# Altium schematic sheet Vertigo Core.SchDoc
size A2; PageSetup: Record=PageOptions|CenterHorizontal=True|CenterVertical=True|PrintScale=0.71|XCorrection=1.00|YCorrection=1.00|PrintKind=1|BorderSize=5000000|LeftOffset=0|BottomOffset=0|Orientation=2|PaperLength=1000|PaperWidth=1000|Scale=100|PaperSource=7|PrintQuality=-4|MediaType=1|DitherType=10|PaperKind=A3 (297 x 420 mm)|PrintScaleMode=1
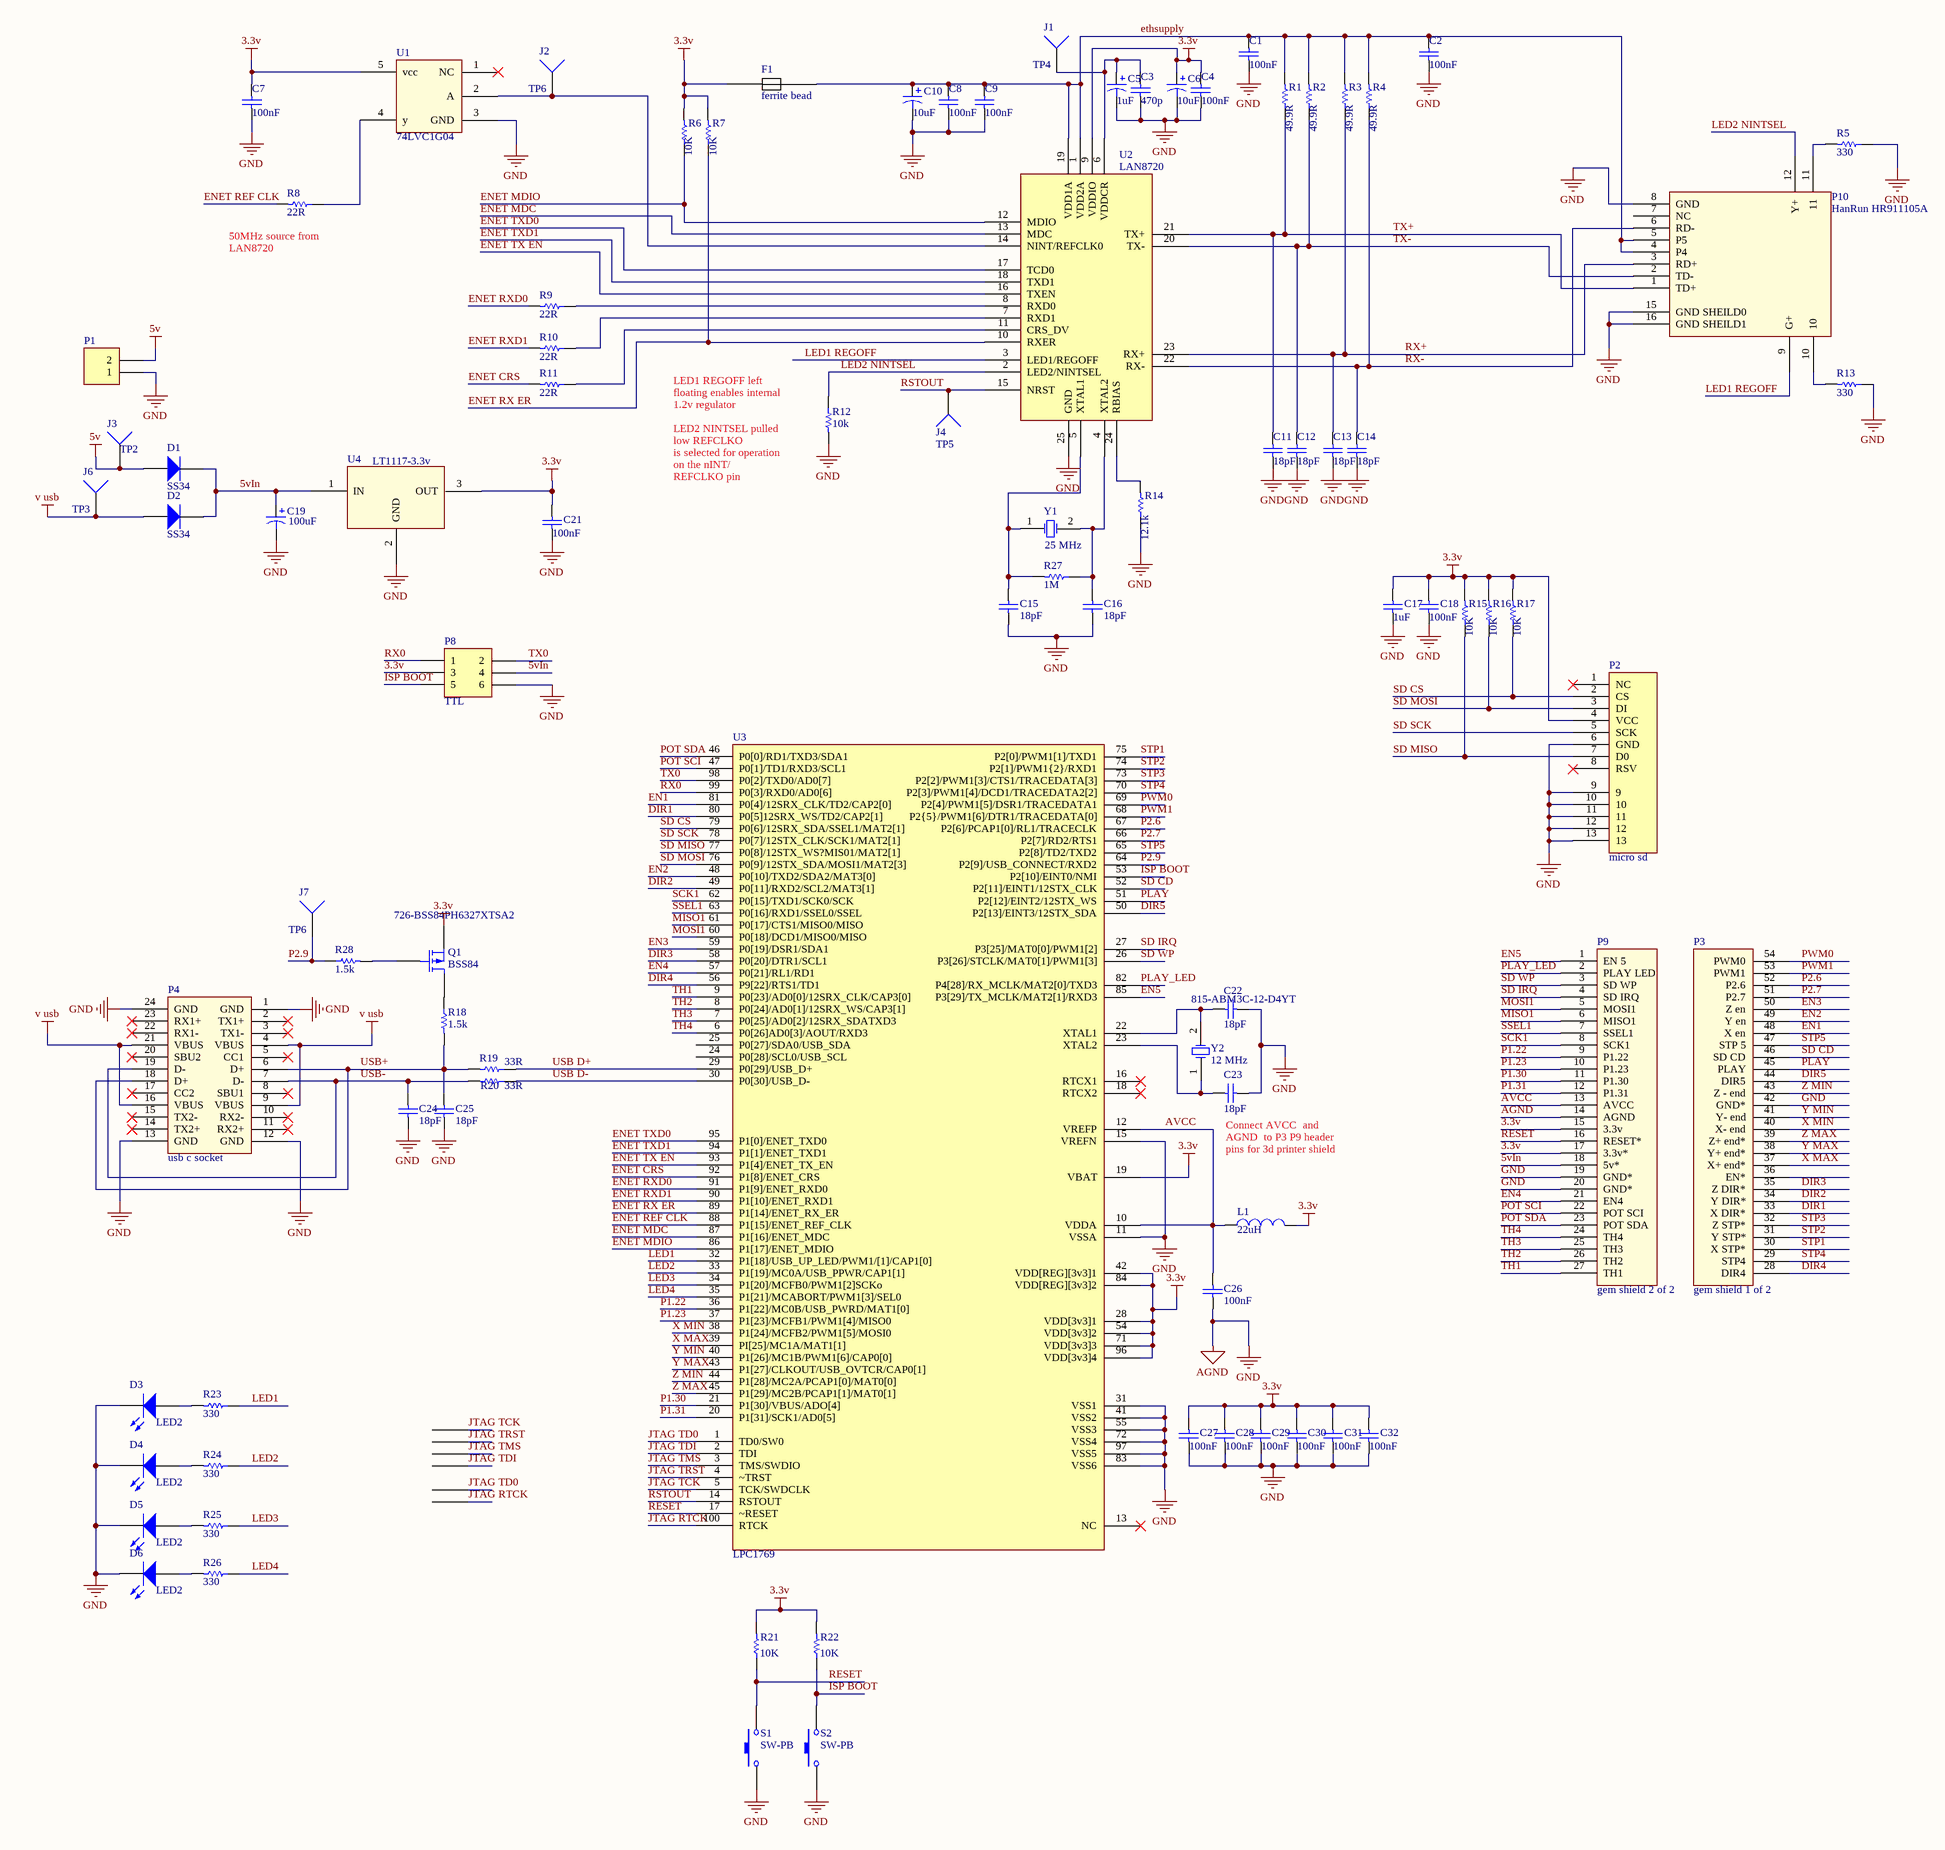
[diagram p0: Vertigo Core.SchDoc]

## Parts
C1  100nF  [0805]
C2  100nF  [0805]
C3  value 470p  [0805]  (hidden comment: 470pF)
C4  100nF  [0805]
C5  1uF  [0805]
C6  10uF  [0805]
C7  100nF  [0805]
C8  100nF  [0805]
C9  100nF  [0805]
C10  10uF  [0805]
C11  18pf  [0805]
C12  18pf  [0805]
C13  18pf  [0805]
C14  18pf  [0805]
C15  18pF  [0805]
C16  18pF  [0805]
C17  1uF  [0805]
C18  100nF  [0805]
C19  value 100uF  [470uf/ 100uf 50v smd]  (hidden comment: 10uF)
C21  100nF  [0805]
C22  18pF  [0805]
C23  18pF  [0805]
C24  18pF  [0805]
C25  18pF  [0805]
C26  100nF  [0805]
C27  100nF  [0805]
C28  100nF  [0805]
C29  100nF  [0805]
C30  100nF  [0805]
C31  100nF  [0805]
C32  100nF  [0805]
D1  SS34  [Diode]
D2  SS34  [Diode]
D3  LED2  [0805 LED]
D4  LED2  [0805 LED]
D5  LED2  [0805 LED]
D6  LED2  [0805 LED]
F1  ferrite bead  [0805]
J1  TP4  [test point]
J2  TP6  [test point]
J3  TP2  [test point]
J4  TP5  [test point]
J6  TP3  [test point]
J7  TP6  [test point]
L1  22uH  [0805]
P1  Header 2  [HDR1X2]  (value not drawn)
P2  micro sd  [DM3 SD card]
P3  gem shield 1 of 2  [gem shield 1 of 2]
P4  usb c socket  [USB C type]
P5  JTAG2  [JTAG2]  (value not drawn)
P6  JTAG  [JTAG]  (value not drawn)
P8  TTL  [HDR2X3]
P9  gem shield 2 of 2  [gem shield 2 of 2]
P10  HanRun HR911105A  [Hanrun]
Q1  BSS84  Supplier Part Number 1: 726-BSS84PH6327XTSA2  [SOT23]
R1  value 49.9R  [0805]  (hidden comment: 49.9)
R2  value 49.9R  [0805]  (hidden comment: 49.9)
R3  value 49.9R  [0805]  (hidden comment: 49.9)
R4  value 49.9R  [0805]  (hidden comment: 49.9)
R5  330  [0805]
R6  10k  [0805]
R7  10k  [0805]
R8  22R  [0603]
R9  22R  [0603]
R10  22R  [0603]
R11  22R  [0603]
R12  10k  [0805]
R13  330  [0805]
R14  12.1k  [0805]
R15  10k  [0805]
R16  10k  [0805]
R17  10k  [0805]
R18  1.5K  [0603]
R19  33R  [0805]
R20  33R  [0805]
R21  10k  [0805]
R22  10k  [0805]
R23  330  [0805]
R24  330  [0805]
R25  330  [0805]
R26  330  [0805]
R27  1M  [0805]
R28  1.5K  [0603]
S1  SW-PB  [SMD_push_button]
S2  SW-PB  [SMD_push_button]
U1  74LVC1G04  [SOT23-5]
U2  LAN8720  [QFN50P400X400X100-24N]
U3  LPC1769  [TSQFP50P1600X1600X160_HS-101N]
U4  LT1117-3.3v  [SOT223]
Y1  25 MHz  [25 MHz crystal M445]
Y2  12 MHz  Supplier Part Number 4: 815-ABM3C-12-D4YT  [SMD_crystal]

## Nets
3.3v: C4.1 C6.1 C7.1 C17.2 C18.2 C21.2 C27.2 C28.2 C29.2 C30.2 C31.2 C32.2 F1.1 L1.2 P2.4(VCC) P8.3 P9.15(3.3v) P9.17(3.3v*) Q1.3(S) R6.2 R7.2 R15.2 R16.2 R17.2 R21.2 R22.2 U1.5(vcc) U2.9(VDDIO) U3.19(VBAT) U3.28(VDD[3v3]1) U3.42(VDD[REG][3v3]1) U3.54(VDD[3v3]2) U3.71(VDD[3v3]3) U3.84(VDD[REG][3v3]2) U3.96(VDD[3v3]4) U4.3(OUT)
5v: D1.1(A) J3.1 P1.2
AGND: C1.2 C2.2 C3.2 C4.2 C5.2 C6.2 C7.2 C8.2 C9.2 C10.2 C11.2 C12.2 C13.2 C14.2 C15.1 C16.1 C17.1 C18.1 C19.2 C21.1 C22.1 C23.1 C24.2 C25.2 C26.2 C27.1 C28.1 C29.1 C30.1 C31.1 C32.1 D3.2(K) D4.2(K) D5.2(K) D6.2(K) P1.1 P2.6(GND) P2.9 P2.10 P2.11 P2.12 P2.13 P3.42(GND*) P4.1(GND) P4.12(GND) P4.13(GND) P4.24(GND) P8.6 P9.14(AGND) P9.19(GND*) P9.20(GND*) P10.8(GND) P10.15(GND_SHEILD0) P10.16(GND_SHEILD1) R5.1 R12.2 R13.1 R14.1 S1.1 S2.1 U1.3(GND) U2.25(GND) U3.11(VSSA) U3.15(VREFN) U3.31(VSS1) U3.41(VSS2) U3.55(VSS3) U3.72(VSS4) U3.83(VSS6) U3.97(VSS5) U4.2(GND)  [also labelled GND]
v usb: D2.1(A) J6.1 P4.4(VBUS) P4.9(VBUS) P4.16(VBUS) P4.21(VBUS)
5vIn: C19.1 D1.2(K) D2.2(K) P8.4 P9.18(5v*) U4.1(IN)
AVCC: C26.1 L1.1 P9.13(AVCC) U3.10(VDDA) U3.12(VREFP)
DIR1: P3.33(X_DIR*) U3.80(P0[5]12SRX_WS/TD2/CAP2[1])
DIR2: P3.34(Y_DIR*) U3.49(P0[11]/RXD2/SCL2/MAT3[1])
DIR3: P3.35(Z_DIR*) U3.58(P0[20]/DTR1/SCL1)
DIR4: P3.28(DIR4) U3.56(P9[22]/RTS1/TD1)
DIR5: P3.44(DIR5) U3.50(P2[13]/EINT3/12STX_SDA)
EN1: P3.48(X_en) U3.81(P0[4]/12SRX_CLK/TD2/CAP2[0])
EN2: P3.49(Y_en) U3.48(P0[10]/TXD2/SDA2/MAT3[0])
EN3: P3.50(Z_en) U3.59(P0[19]/DSR1/SDA1)
EN4: P9.21(EN4) U3.57(P0[21]/RL1/RD1)
EN5: P9.1(EN_5) U3.85(P3[29]/TX_MCLK/MAT2[1]/RXD3)
ENET CRS: R11.2 U3.92(P1[8]/ENET_CRS)
ENET MDC: U2.13(MDC) U3.87(P1[16]/ENET_MDC)
ENET MDIO: R6.1 U2.12(MDIO) U3.86(P1[17]/ENET_MDIO)
ENET REF CLK: R8.2 U3.88(P1[15]/ENET_REF_CLK)
ENET RX ER: R7.1 U2.10(RXER) U3.89(P1[14]/ENET_RX_ER)
ENET RXD0: R9.2 U3.91(P1[9]/ENET_RXD0)
ENET RXD1: R10.2 U3.90(P1[10]/ENET_RXD1)
ENET TX EN: U2.16(TXEN) U3.93(P1[4]/ENET_TX_EN)
ENET TXD0: U2.17(TCD0) U3.95(P1[0]/ENET_TXD0)
ENET TXD1: U2.18(TXD1) U3.94(P1[1]/ENET_TXD1)
ethsupply: C1.1 C2.1 C8.1 C9.1 C10.1 F1.2 P10.4(P4) P10.5(P5) R1.2 R2.2 R3.2 R4.2 U2.1(VDD2A) U2.19(VDD1A)
ISP BOOT: P8.5 R22.1 S2.2 U3.53(P2[10]/EINT0/NMI)
JTAG RTCK: P5.1 U3.100(RTCK)
JTAG TCK: P6.4 U3.5(TCK/SWDCLK)
JTAG TD0: P5.2 U3.1(TD0/SW0)
JTAG TDI: P6.1 U3.2(TDI)
JTAG TMS: P6.2 U3.3(TMS/SWDIO)
JTAG TRST: P6.3 U3.4(~TRST)
LED1: R23.1 U3.32(P1[18]/USB_UP_LED/PWM1/[1]/CAP1[0])
LED1 REGOFF: P10.9(G+) U2.3(LED1/REGOFF)
LED2: R24.1 U3.33(P1[19]/MC0A/USB_PPWR/CAP1[1])
LED2 NINTSEL: P10.12(Y+) R12.1 U2.2(LED2/NINTSEL)
LED3: R25.1 U3.34(P1[20]/MCFB0/PWM1[2]SCKo)
LED4: R26.1 U3.35(P1[21]/MCABORT/PWM1[3]/SEL0)
MISO1: P9.6(MISO1) U3.61(P0[17]/CTS1/MISO0/MISO)
MOSI1: P9.5(MOSI1) U3.60(P0[18]/DCD1/MISO0/MISO)
P1.22: P9.9(P1.22) U3.36(P1[22]/MC0B/USB_PWRD/MAT1[0])
P1.23: P9.10(P1.23) U3.37(P1[23]/MCFB1/PWM1[4]/MISO0)
P1.30: P9.11(P1.30) U3.21(P1[30]/VBUS/ADO[4])
P1.31: P9.12(P1.31) U3.20(P1[31]/SCK1/AD0[5])
P2.6: P3.52(P2.6) U3.67(P2[6]/PCAP1[0]/RL1/TRACECLK)
P2.7: P3.51(P2.7) U3.66(P2[7]/RD2/RTS1)
P2.9: J7.1 R28.1 U3.64(P2[9]/USB_CONNECT/RXD2)
PLAY: P3.45(PLAY) U3.51(P2[12]/EINT2/12STX_WS)
PLAY_LED: P9.2(PLAY_LED) U3.82(P4[28]/RX_MCLK/MAT2[0]/TXD3)
POT SCI: P9.22(POT_SCI) U3.47(P0[1]/TD1/RXD3/SCL1)
POT SDA: P9.23(POT_SDA) U3.46(P0[0]/RD1/TXD3/SDA1)
PWM0: P3.54(PWM0) U3.69(P2[4]/PWM1[5]/DSR1/TRACEDATA1)
PWM1: P3.53(PWM1) U3.68(P2{5}/PWM1[6]/DTR1/TRACEDATA[0])
RESET: P9.16(RESET*) R21.1 S1.2 U3.17(~RESET)
RSTOUT: J4.1 U2.15(NRST) U3.14(RSTOUT)
RX0: P8.1 U3.99(P0[3]/RXD0/AD0[6])
RX+: C13.1 P10.3(RD+) R3.1 U2.23(RX+)
RX-: C14.1 P10.6(RD-) R4.1 U2.22(RX-)
SCK1: P9.8(SCK1) U3.62(P0[15]/TXD1/SCK0/SCK)
SD CD: P3.46(SD_CD) U3.52(P2[11]/EINT1/12STX_CLK)
SD CS: P2.2(CS) R17.1 U3.79(P0[6]/12SRX_SDA/SSEL1/MAT2[1])
SD IRQ: P9.4(SD_IRQ) U3.27(P3[25]/MAT0[0]/PWM1[2])
SD MISO: P2.7(D0) R15.1 U3.77(P0[8]/12STX_WS?MIS01/MAT2[1])
SD MOSI: P2.3(DI) R16.1 U3.76(P0[9]/12STX_SDA/MOSI1/MAT2[3])
SD SCK: P2.5(SCK) U3.78(P0[7]/12STX_CLK/SCK1/MAT2[1])
SD WP: P9.3(SD_WP) U3.26(P3[26]/STCLK/MAT0[1]/PWM1[3])
SSEL1: P9.7(SSEL1) U3.63(P0[16]/RXD1/SSEL0/SSEL)
STP1: P3.30(X_STP*) U3.75(P2[0]/PWM1[1]/TXD1)
STP2: P3.31(Y_STP*) U3.74(P2[1]/PWM1{2}/RXD1)
STP3: P3.32(Z_STP*) U3.73(P2[2]/PWM1[3]/CTS1/TRACEDATA[3])
STP4: P3.29(STP4) U3.70(P2[3]/PWM1[4]/DCD1/TRACEDATA2[2])
STP5: P3.47(STP_5) U3.65(P2[8]/TD2/TXD2)
TH1: P9.27(TH1) U3.9(P0[23]/AD0[0]/12SRX_CLK/CAP3[0])
TH2: P9.26(TH2) U3.8(P0[24]/AD0[1]/12SRX_WS/CAP3[1])
TH3: P9.25(TH3) U3.7(P0[25]/AD0[2]/12SRX_SDATXD3)
TH4: P9.24(TH4) U3.6(P0[26]AD0[3]/AOUT/RXD3)
TX0: P8.2 U3.98(P0[2]/TXD0/AD0[7])
TX+: C11.1 P10.1(TD+) R1.1 U2.21(TX+)
TX-: C12.1 P10.2(TD-) R2.1 U2.20(TX-)
USB D+: R19.1 U3.29(P0[29]/USB_D+)
USB D-: R20.1 U3.30(P0[30]/USB_D-)
USB+: C25.1 P4.6(D+) P4.18(D+) R18.2 R19.2
USB-: C24.1 P4.7(D-) P4.19(D-) R20.2
X MAX: P3.37(X+_end*) U3.39(PI[25]/MC1A/MAT1[1])
X MIN: P3.40(X-_end) U3.38(P1[24]/MCFB2/PWM1[5]/MOSI0)
Y MAX: P3.38(Y+_end*) U3.43(P1[27]/CLKOUT/USB_OVTCR/CAP0[1])
Y MIN: P3.41(Y-_end) U3.40(P1[26]/MC1B/PWM1[6]/CAP0[0])
Z MAX: P3.39(Z+_end*) U3.45(P1[29]/MC2B/PCAP1[1]/MAT0[1])
Z MIN: P3.43(Z_-_end) U3.44(P1[28]/MC2A/PCAP1[0]/MAT0[0])
NetC3_1: C3.1 C5.1 J1.1 U2.6(VDDCR)
NetC15_2: C15.2 R27.2 U2.5(XTAL1) Y1.1(OSC1)
NetC16_2: C16.2 R27.1 U2.4(XTAL2) Y1.2(OSC2)
NetC22_2: C22.2 U3.22(XTAL1) Y2.2(OSC2)
NetC23_2: C23.2 U3.23(XTAL2) Y2.1(OSC1)
NetD3_1: D3.1(A) R23.2
NetD4_1: D4.1(A) R24.2
NetD5_1: D5.1(A) R25.2
NetD6_1: D6.1(A) R26.2
NetJ2_1: J2.1 U1.2(A) U2.14(NINT/REFCLK0)
NetP10_10: P10.10 R13.2
NetP10_11: P10.11 R5.2
NetQ1_1: Q1.1(D) R18.1
NetQ1_2: Q1.2(G) R28.2
NetR8_1: R8.1 U1.4(y)
NetR9_1: R9.1 U2.8(RXD0)
NetR10_1: R10.1 U2.7(RXD1)
NetR11_1: R11.1 U2.11(CRS_DV)
NetR14_2: R14.2 U2.24(RBIAS)

Not connected (* = marked no-connect by the designer): P2 1(NC)* 8(RSV)*; P3 36(EN*); P4 2(TX1+)* 3(TX1-)* 5(CC1)* 8(SBU1)* 10(RX2-)* 11(RX2+)* 14(TX2+)* 15(TX2-)* 17(CC2)* 20(SBU2)* 22(RX1-)* 23(RX1+)*; P10 7(NC); U1 1(NC)*; U3 13(NC)* 16(RTCX1)* 18(RTCX2)* 24(P0[28]/SCL0/USB_SCL) 25(P0[27]/SDA0/USB_SDA)

## Notes on the sheet
- (near R8) 50MHz source from LAN8720
- (near R12) LED1 REGOFF left floating enables internal 1.2v regulator
- LED2 NINTSEL pulled low REFCLKO
  is selected for operation on the nINT/
  REFCLKO pin
- (near C23) Connect AVCC  and  AGND  to P3 P9 header pins for 3d printer shield

## Library data of the parts
C1-C4 C7-C9 C11-C18 C21-C32 = Cap Semi: Capacitor (Semiconductor SIM Model); Published: 8-Jun-2000; LatestRevisionDate: 29-May-2009; LatestRevisionNote: IPC-7351 Footprint Added.; PackageReference: C1206; Publisher: Altium Limited; PackageDescription: Chip Capacitor
  C1 C2 C4 C7-C9 C18 C21 C26-C32: Value: 100nF
  C11-C16 C24 C25: Value: 18pF
  C17: Value: 1uF
  C22 C23: Value: 18pF; Supplier 1: Mouser
C5 C6 C10 C19 = Cap Pol1: Polarized Capacitor (Radial); Published: 8-Jun-2000; LatestRevisionDate: 17-Jul-2002; LatestRevisionNote: Re-released for DXP Platform.; PackageReference: RB7.6-15; Publisher: Altium Limited; PackageDescription: Polarized Capacitor (Radial); 2 Leads
  C5: Value: 1uF; Supplier 1: Mouser; Supplier Part Number 1: 81-GRM21BR71H105KA2L
  C6 C10: Value: 10uF
D1 D2 = Diode 1N914: High Conductance Fast Diode; Published: 8-Jun-2000; LatestRevisionDate: 17-Jul-2002; LatestRevisionNote: Re-released for DXP Platform.; DatasheetVersion: 1997; PackageReference: DO-35; Publisher: Altium Limited; PackageDescription: Diode, Axial; Body 3.8 x 1.9 mm (LxDia. max), Lead Dia. 0.53 mm (max); Code_JEDEC: DO-204-AH; ComponentLink1Description: Manufacturer Link; ComponentLink1URL: http://www.fairchildsemi.com/; ComponentLink2Description: Datasheet; ComponentLink2URL: http://www.fairchildsemi.com/ds/1N%2F1N4448.pdf
D3-D6 = LED2: Typical RED, GREEN, YELLOW, AMBER GaAs LED; Published: 8-Jun-2000; LatestRevisionDate: 17-Jul-2002; LatestRevisionNote: Re-released for DXP Platform.; PackageVersion: Feb-2002; PackageReference: 3.2X1.6X1.1; Publisher: Altium Limited; PackageDescription: SM LED; 2 Flat Leads
J1-J4 J6 J7 = Socket: LatestRevisionDate: 17-Jul-2002; LatestRevisionNote: Re-released for DXP Platform.; Publisher: Altium Limited
L1 = Inductor: Code_IEC: 1005; Published: 8-Jun-2000; LatestRevisionDate: 29-May-2009; LatestRevisionNote: IPC-7351 Footprint Added.; PackageReference: 0402-A; Publisher: Altium Limited; PackageDescription: Chip Inductor; Code_JEITA: 0402; Value: 22uH
P1 = Header 2: Header, 2-Pin; LatestRevisionDate: 17-Jul-2002; LatestRevisionNote: Re-released for DXP Platform.; Publisher: Altium Limited
P4 = usb c socket: Mouser 538-105450-0101
P8 = Header 3X2: Header, 3-Pin, Dual row; LatestRevisionDate: 17-Jul-2002; LatestRevisionNote: Re-released for DXP Platform.; Publisher: Altium Limited
P10 = RJ45
Q1 = MOSFET-P: P-Channel MOSFET; pin to pad: 1>3 2>1 3>2; Published: 8-Jun-2000; LatestRevisionDate: 17-Jul-2002; LatestRevisionNote: Re-released for DXP Platform.; PackageVersion: 1995/1996; PackageReference: E3; Publisher: Altium Limited; PackageDescription: TO, Flat Index; 3 In-Line, Axial Leads; Body Dia. 4.6mm; Lead Dia. 0.5 mm (max); Supplier 1: Mouser
R1-R28 = Res1: Resistor; Published: 8-Jun-2000; LatestRevisionDate: 17-Jul-2002; LatestRevisionNote: Re-released for DXP Platform.; PackageReference: AXIAL-0.3; Publisher: Altium Limited; PackageDescription: Axial Device, Thru-Hole; 2 Leads; 0.3 in Pin Spacing
  R5 R13 R23-R26: Value: 330
  R6 R7 R15-R17 R21 R22: Value: 10K
  R8-R11: Value: 22R
  R12: Value: 10k
  R14: Value: 12.1k
  R18 R28: Value: 1.5k; Supplier 1: Mouser; Supplier Part Number 1: 755-ESR10EZPJ152
  R19 R20: Value: 33R
  R27: Value: 1M
S1 S2 = SW-PB: Switch; Published: 24-Mar-1999; LatestRevisionDate: 17-Jul-2002; LatestRevisionNote: Re-released for DXP Platform.; PackageReference: SPST-2; Publisher: Altium Limited; PackageDescription: Switch; 2 Leads
Y1 Y2 = XTAL: Crystal Oscillator; Published: 8-Jun-2000; LatestRevisionDate: 17-Jul-2002; LatestRevisionNote: Re-released for DXP Platform.; PackageReference: R38; Publisher: Altium Limited; PackageDescription: Crystal, Thru-Hole; 2 Leads; Body 3.1 x 8.2 mm (Dia.xH)
  Y2: Supplier 1: Mouser; Supplier 2: Mouser; Supplier 3: Mouser; Supplier 4: Mouser
F1 = ferrite bead: Supplier 1: Digi-Key; Supplier Part Number 1: 445-1565-1-ND; Supplier 2: Mouser; Supplier Part Number 2: 810-MPZ1608S300A; Supplier 3: Mouser; Supplier 4: Mouser; Supplier Part Number 4: 652-MH2029-300Y
P2 = micro sd: Supplier 1: Mouser; Supplier Part Number 1: 798-DM3D-SF